# EAGLE schematic BoeBot-Schematic (EAGLE 8.0.2)
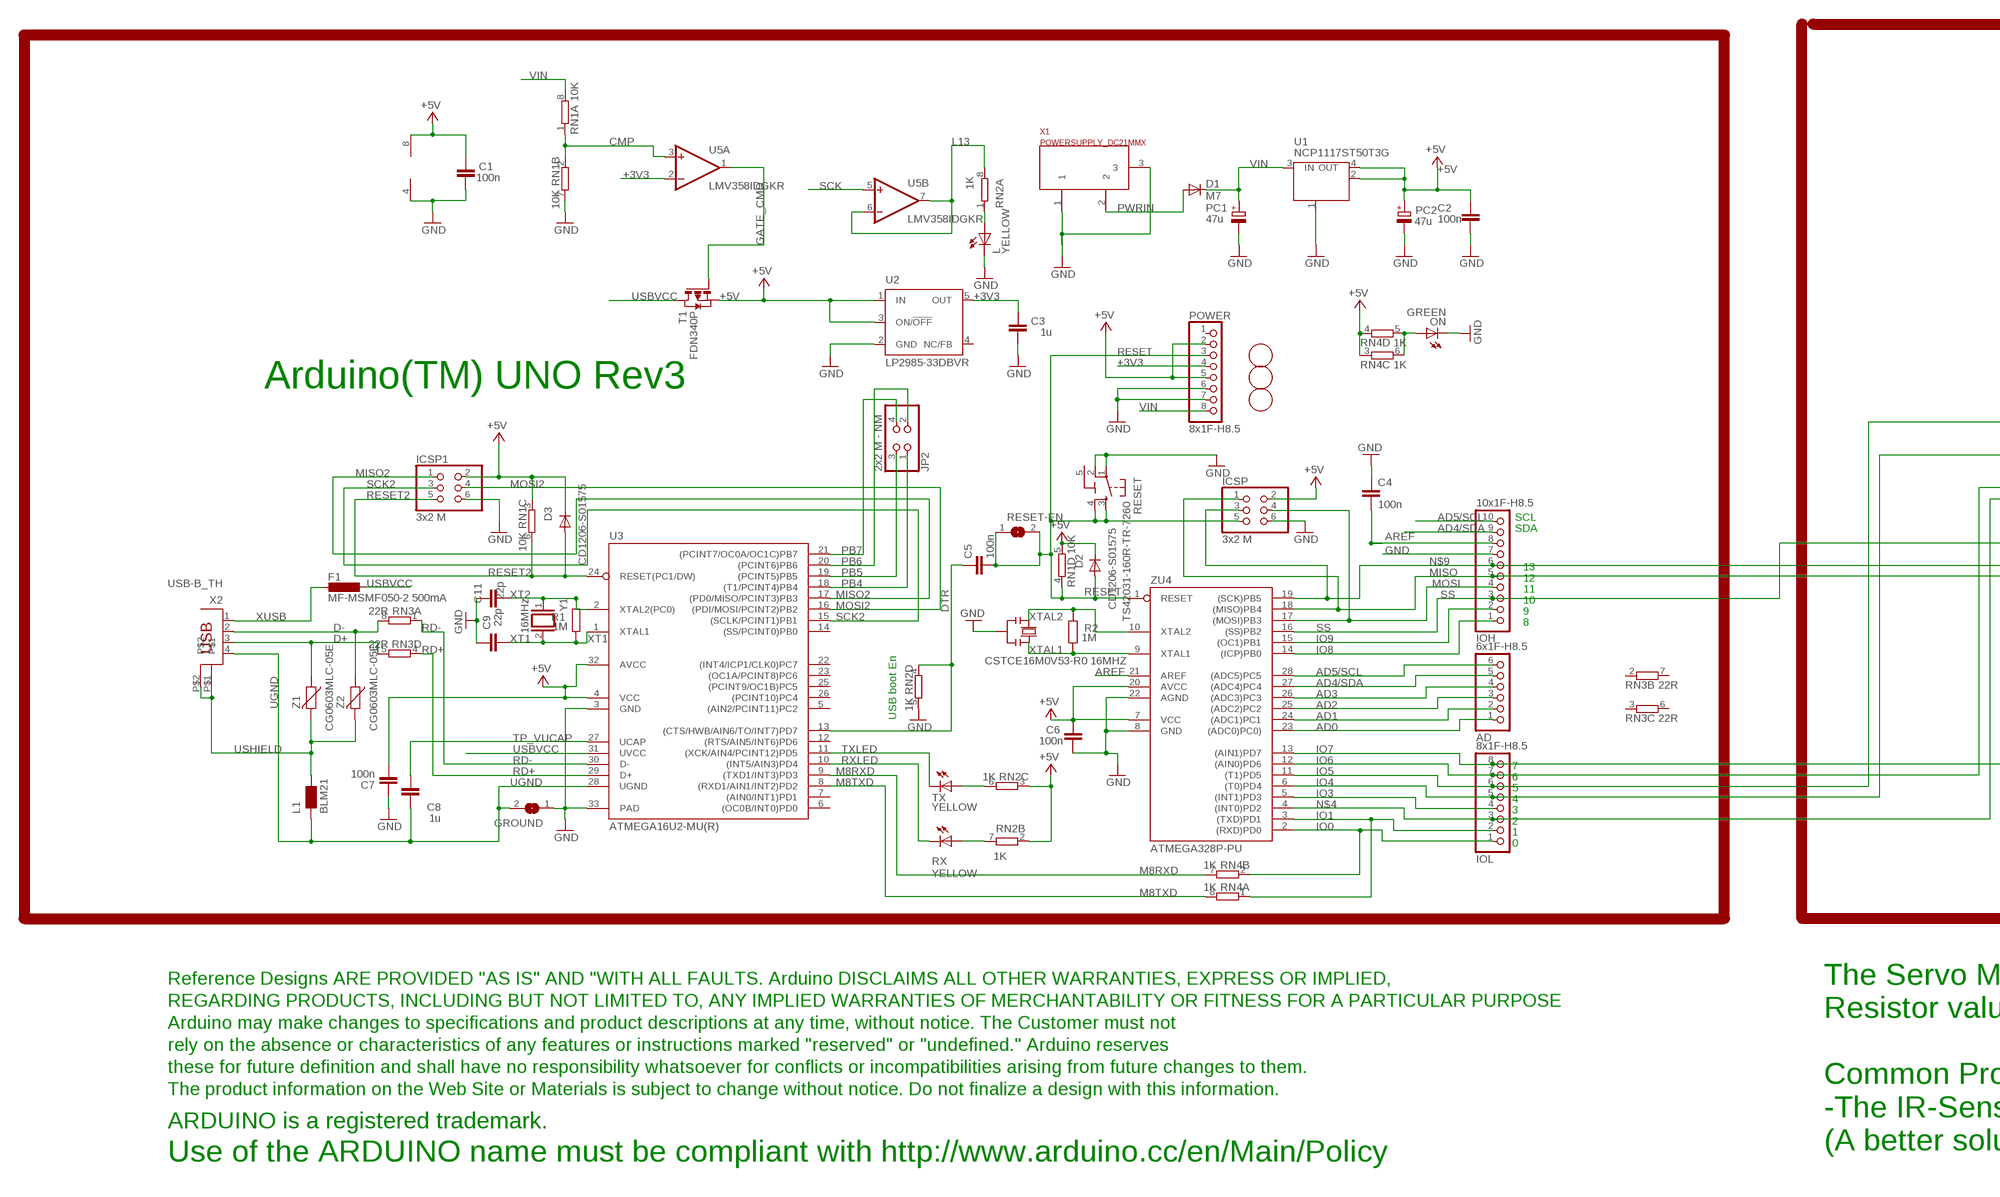
[diagram p0: schematic, sheet 1, part 1 of 2]
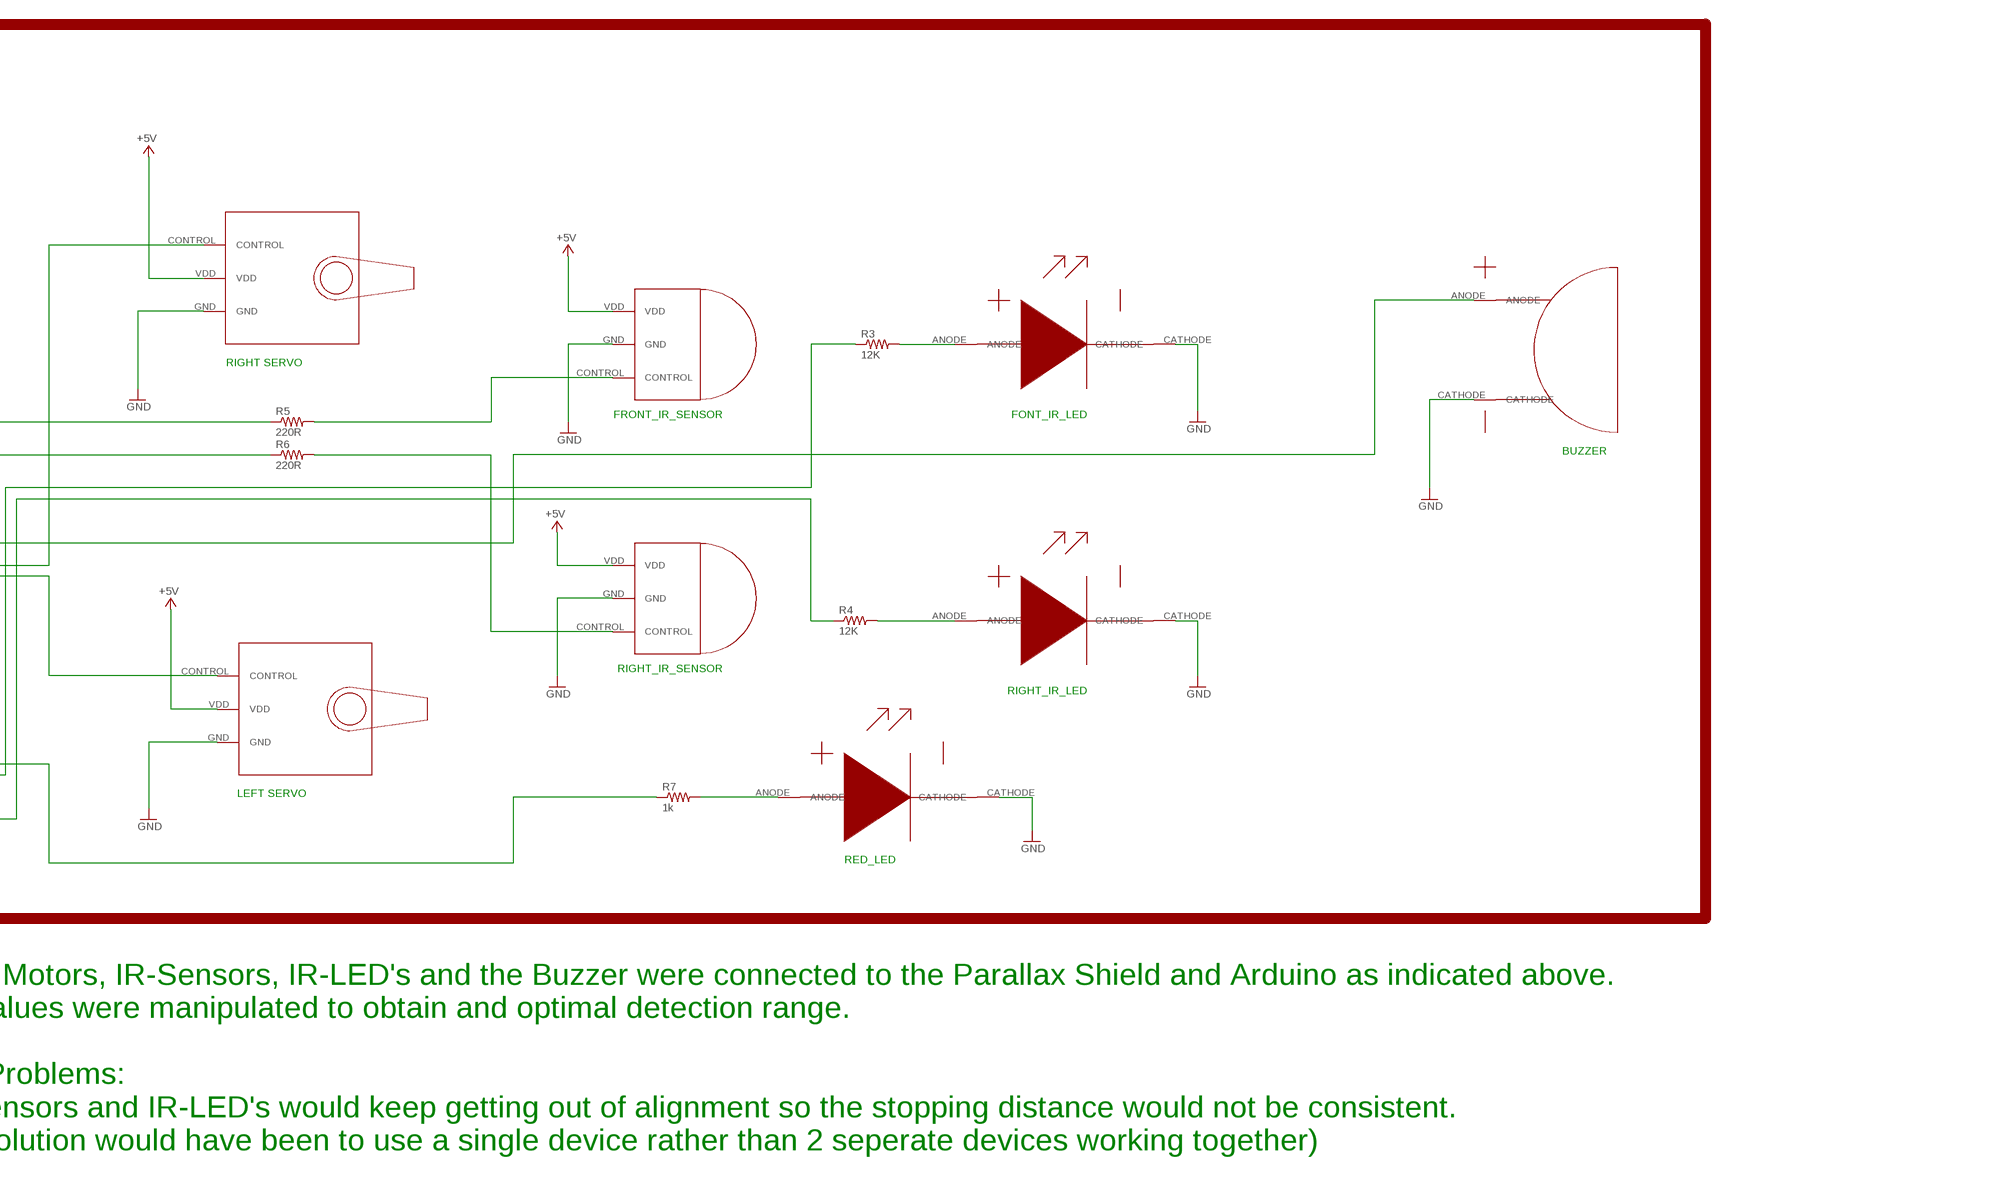
[diagram p1: schematic, sheet 1, part 2 of 2]

## Parts
AD  6x1F-H8.5  PINHD-1X6  [1X06]
C1  100n  C-EU0603-RND  [C0603-ROUND]
C2  100n  C-EU0603-RND  [C0603-ROUND]
C3  1u  C-EU0603-RND  [C0603-ROUND]
C4  100n  C-EU0603-RND  [C0603-ROUND]
C5  100n  C-EU0603-RND  [C0603-ROUND]
C6  100n  C-EU0603-RND  [C0603-ROUND]
C7  100n  C-EU0603-RND  [C0603-ROUND]
C8  1u  C-EU0603-RND  [C0603-ROUND]
C9  22p  C-EU0603-RND  [C0603-ROUND]
C11  22p  C-EU0603-RND  [C0603-ROUND]
D1  M7  DIODE-SMB  [SMB]
D2  CD1206-S01575  DIODE-MINIMELF  [MINIMELF]
D3  CD1206-S01575  DIODE-MINIMELF  [MINIMELF]
F1  MF-MSMF050-2 500mA  L-EUL1812  [L1812]
FD1  FIDUCIALMOUNT  [FIDUCIA-MOUNT]
FD2  FIDUCIALMOUNT  [FIDUCIA-MOUNT]
FD3  FIDUCIALMOUNT  [FIDUCIA-MOUNT]
GROUND  SJ  [SJ]
ICSP  3x2 M  PINHD-2X3  [2X03]
ICSP1  3x2 M  PINHD-2X3  [2X03]
IOH  10x1F-H8.5  PINHD-1X10_ARD  [1X10]
IOL  8x1F-H8.5  PINHD-1X8  [1X08]
JP2  2x2 M - NM  PINHD-2X2  [2X02]
L  YELLOW  LEDCHIP-LED0805  [CHIP-LED0805]
L1  BLM21  WE-CBF_0805  [0805]
ON  GREEN  LEDCHIP-LED0805  [CHIP-LED0805]
PC1  47u  CPOL-EUD  [PANASONIC_D]
PC2  47u  CPOL-EUD  [PANASONIC_D]
POWER  8x1F-H8.5  PINHD-1X8  [1X08]
R1  1M  R-EU_R0603  [R0603-ROUND]
R2  1M  R-EU_R0603  [R0603-ROUND]
R3  12K  R-US_0411/15  [0411/15]
R4  12K  R-US_0411/15  [0411/15]
R5  220R  R-US_0207/2V  [0207/2V]
R6  220R  R-US_0207/2V  [0207/2V]
R7  1k  R-US_0207/2V  [0207/2V]
RESET  TS42031-160R-TR-7260  TS42  [TS42]
RESET-EN  SJ  [SJ]
RIGHT_IR_LED  asdfa  IR_SENSOR  [IR_SENSOR]
RIGHT_SERVO  IR_LED  [IR_LED]
RN1  10K  4R-NCAY16  [CAY16]
RN2  1K  4R-NCAY16  [CAY16]
RN3  22R  4R-NCAY16  [CAY16]
RN4  1K  4R-NCAY16  [CAY16]
RX  YELLOW  LEDCHIP-LED0805  [CHIP-LED0805]
T1  FDN340P  PMOSSOT23  [SOT-23]
TX  YELLOW  LEDCHIP-LED0805  [CHIP-LED0805]
U1  NCP1117ST50T3G  MC33269ST-3.3T3  [SOT223]
U2  LP2985-33DBVR  LP2985-XXDBVR33  [SOT23-DBV]
U3  ATMEGA16U2-MU(R)  ATMEGA16U2-MU  [MLF32]
U5  LMV358IDGKR  LMV358MMX  [MSOP08]
U$1  DISCLAIMER  [DISCLAIMER]
U$2  BUZZER  [BUZZER]
U$3  IR_LED  [IR_LED]
U$4  IR_LED  [IR_LED]
U$5  IR_SENSOR  [IR_SENSOR]
U$6  IR_LED  [IR_LED]
U$7  IR_LED  [IR_LED]
X1  POWERSUPPLY_DC21MMX  [POWERSUPPLY_DC-21MM]
X2  USB-B_TH  PN61729  [PN61729]
Y1  16MHz  XTAL/S  [QS]
Y2  CSTCE16M0V53-R0 16MHZ  RESONATORMU  [RESONATOR]
Z1  CG0603MLC-05E  VARISTORCN0603  [CT/CN0603]
Z2  CG0603MLC-05E  VARISTORCN0603  [CT/CN0603]
ZU4  ATMEGA328P-PU  [DIL28-3]

## Nets
+3V3: C3.2 POWER.4 U2.5(OUT) U5.2(A:-IN)
+5V [usbvcc]: C1.2 C2.2 C6.2 C7.1 D2.C D3.C ICSP1.2 ICSP.2 PC2.+ POWER.2 POWER.5 RIGHT_IR_LED.VDD RIGHT_SERVO.VDD RN1.3 RN1.5 RN2.2 RN2.3 RN4.3 RN4.4 T1.2(S) U1.2(OUT) U1.4(OUT) U2.1(IN) U2.3(ON/!OFF) U3.4(VCC) U3.32(AVCC) U5.8(P:V+) U$3.VDD U$5.VDD ZU4.7(VCC) ZU4.20(AVCC)
AD0: AD.1 ZU4.23((ADC0)PC0))
AD1: AD.2 ZU4.24((ADC1)PC1)
AD2: AD.3 ZU4.25((ADC2)PC2)
AD3: AD.4 ZU4.26((ADC3)PC3)
AD4/SDA: AD.5 IOH.9 ZU4.27((ADC4)PC4)
AD5/SCL: AD.6 IOH.10 ZU4.28((ADC5)PC5)
AREF [aref]: C4.2 IOH.8 ZU4.21(AREF)
CMP: RN1.1 RN1.2 U5.3(A:+IN)
D+: RN3.5 X2.3 Z1.1
D-: RN3.8 X2.2 Z2.1
DTR: C5.1 RN2.4 U3.13((CTS/HWB/AIN6/TO/INT7)PD7)
GATE_CMD: T1.3(G) U5.1(A:OUT)
GND [gnd]: C1.1 C2.1 C3.1 C4.1 C6.1 C7.2 C9.2 C11.2 GROUND.1 ICSP1.6 ICSP.6 IOH.7 L.C ON.C PC1.- PC2.- POWER.6 POWER.7 RESET.1 RESET.2 RIGHT_IR_LED.GND RIGHT_SERVO.GND RN1.7 RN2.5 U1.1(GND/ADJ) U2.2(GND) U3.3(GND) U3.33(PAD) U5.4(P:V-) U$2.CATHODE U$3.GND U$4.CATHODE U$5.GND U$6.CATHODE U$7.CATHODE X1.1 X1.3 Y2.2 ZU4.8(GND) ZU4.22(AGND)
IO0: IOL.1 RN4.2 ZU4.2((RXD)PD0)
IO1: IOL.2 RN4.1 ZU4.3((TXD)PD1)
IO3: IOL.4 ZU4.5((INT1)PD3)
IO4: IOL.5 R6.1 ZU4.6((T0)PD4)
IO5: IOL.6 R5.1 ZU4.11((T1)PD5)
IO6: IOL.7 R3.1 ZU4.12((AIN0)PD6)
IO7: IOL.8 R7.1 ZU4.13((AIN1)PD7)
IO8: IOH.1 ZU4.14((ICP)PB0)
IO9: IOH.2 ZU4.15((OC1)PB1)
L13: RN2.8 U5.6(B:-IN) U5.7(B:OUT)
M8RXD: RN4.7 U3.9((TXD1/INT3)PD3)
M8TXD: RN4.8 U3.8((RXD1/AIN1/INT2)PD2)
MISO: ICSP.1 IOH.5 U$3.CONTROL ZU4.18((MISO)PB4)
MISO2: ICSP1.1 U3.17((PD0/MISO/PCINT3)PB3)
MOSI: ICSP.4 IOH.4 ZU4.17((MOSI)PB3)
MOSI2: ICSP1.4 U3.16((PDI/MOSI/PCINT2)PB2)
N$1: L.A RN2.1
N$2: R4.2 U$7.ANODE
N$3: ON.A RN4.5 RN4.6
N$4: IOL.3 R4.1 ZU4.4((INT0)PD2)
N$5: R3.2 U$6.ANODE
N$6: R5.2 RIGHT_IR_LED.CONTROL
N$7: R6.2 U$5.CONTROL
N$8: R7.2 U$4.ANODE
N$9: ICSP.3 IOH.6 RIGHT_SERVO.CONTROL ZU4.19((SCK)PB5)
N$35: RN2.7 RX.A
N$36: RN2.6 TX.A
PB4: JP2.1 U3.18((T1/PCINT4)PB4)
PB5: JP2.3 U3.19((PCINT5)PB5)
PB6: JP2.2 U3.20((PCINT6)PB6)
PB7: JP2.4 U3.21((PCINT7/OC0A/OC1C)PB7)
PWRIN [power]: D1.A X1.2
RD+: RN3.4 U3.29(D+)
RD-: RN3.1 U3.30(D-)
RESET: C5.2 D2.A ICSP.5 POWER.3 RESET-EN.1 RESET-EN.2 RESET.3 RESET.4 RN1.4 ZU4.1(RESET)
RESET2: D3.A ICSP1.5 RN1.6 U3.24(RESET(PC1/DW))
RXLED: RX.C U3.10((INT5/AIN3)PD4)
SCK: U5.5(B:+IN)
SCK2: ICSP1.3 U3.15((SCLK/PCINT1)PB1)
SS: IOH.3 U$2.ANODE ZU4.16((SS)PB2)
TP_VUCAP: C8.1 U3.27(UCAP)
TXLED: TX.C U3.11((XCK/AIN4/PCINT12)PD5)
UGND [gnd]: C8.2 GROUND.2 L1.1 U3.28(UGND) X2.4
USBVCC [usbvcc]: F1.1 T1.1(D) U3.31(UVCC)
USHIELD [gnd]: L1.2 X2.P$1 X2.P$2 Z1.2 Z2.2
VIN [power]: D1.C PC1.+ POWER.8 RN1.8 U1.3(IN)
XT1: C9.1 R1.1 U3.1(XTAL1) Y1.2
XT2: C11.1 R1.2 U3.2(XTAL2(PC0)) Y1.1
XTAL1: R2.1 Y2.3 ZU4.9(XTAL1)
XTAL2: R2.2 Y2.1 ZU4.10(XTAL2)
XUSB [usbvcc]: F1.2 X2.1
Unconnected: POWER.1 RN3.2 RN3.3 RN3.6 RN3.7 U2.4(NC/FB) U3.5((AIN2/PCINT11)PC2) U3.6((OC0B/INT0)PD0) U3.7((AIN0/INT1)PD1) U3.12((RTS/AIN5/INT6)PD6) U3.14((SS/PCINT0)PB0) U3.22((INT4/ICP1/CLK0)PC7) U3.23((OC1A/PCINT8)PC6) U3.25((PCINT9/OC1B)PC5) U3.26((PCINT10)PC4)

## Notes on the sheet
- RIGHT SERVO
- Arduino(TM) UNO Rev3
- FRONT_IR_SENSOR | FONT_IR_LED
- BUZZER
- SCL
- SDA
- 13
- 12
- 11
- 10
- 9
- 8
- RIGHT_IR_SENSOR
- RIGHT_IR_LED
- USB boot En
- 7
- 6
- 5
- LEFT SERVO
- 4
- 3
- 2
- 1
- 0
- RED_LED
- Use of the ARDUINO name must be compliant with http://www.arduino.cc/en/Main/Policy
- The Servo Motors, IR-Sensors, IR-LED's and the Buzzer were connected to the Parallax Shield and Arduino as indicated above. 
  Resistor values were manipulated to obtain and optimal detection range. 
  
  Common Problems:
  -The IR-Sensors and IR-LED's would keep getting out of alignment so the stopping distance would not be consistent.
  (A better solution would have been to use a single device rather than 2 seperate devices working together)

## Power pins joined to a net without a drawn wire
5-GND: RESET.5(5-GND)

## Library data of the parts
AD = SmartPrj:PINHD-1X6: PIN HEADER
C1-C9 C11 = SmartPrj:C-EU: CAPACITOR, European symbol
D1-D3 = diode:DIODE-: DIODE
F1 = rcl:L-EU: INDUCTOR, European symbol
FD1-FD3 = SmartPrj:FIDUCIALMOUNT
GROUND RESET-EN = jumper:SJ: SMD solder JUMPER
ICSP ICSP1 = SmartPrj:PINHD-2X3: PIN HEADER
IOH = SmartPrj:PINHD-1X10_ARD: PIN HEADER
IOL POWER = SmartPrj:PINHD-1X8: PIN HEADER
JP2 = SmartPrj:PINHD-2X2: PIN HEADER
L ON RX TX = led:LED: LED OSRAM: - CHIPLED LG R971, LG N971, LY N971, LG Q971, LY Q971, LO R971, LY R971 LH N974, LH R974 LS Q976, LO Q976, LY Q976 LO Q996 - Hyper CHIPLED LW Q18S LB Q993, LB Q99A, LB R99A - SideLED LS A670, LO A670, LY A670, LG A670, LP A670 LB A673, LV A673, LT A673, LW A673 LH A674 LY A675 LS A676, LA A676, LO A676, LY A676, LW A676 LS A679, LY A679, LG A679 - Hyper Micro SIDELED® LS Y876, LA Y876, LO Y876, LY Y876 LT Y87S - SmartLED LW L88C, LW L88S LB L89C, LB L89S, LG L890 LS L89K, LO L89K, LY L89K LS L896, LA L896, LO L896, LY L896 - TOPLED LS T670, LO T670, LY T670, LG T670, LP T670 LSG T670, LSP T670, LSY T670, LOP T670, LYG T670 LG T671, LOG T671, LSG T671 LB T673, LV T673, LT T673, LW T673 LH T674 LS T676, LA T676, LO T676, LY T676, LB T676, LH T676, LSB T676, LW T676 LB T67C, LV T67C, LT T67C, LS T67K, LO T67K, LY T67K, LW E67C LS E67B, LA E67B, LO E67B, LY E67B, LB E67C, LV E67C, LT E67C LW T67C LS T679, LY T679, LG T679 LS T770, LO T770, LY T770, LG T770, LP T770 LB T773, LV T773, LT T773, LW T773 LH T774 LS E675, LA E675, LY E675, LS T675 LS T776, LA T776, LO T776, LY T776, LB T776 LHGB T686 LT T68C, LB T68C - Hyper Mini TOPLED® LB M676 - Mini TOPLED Santana® LG M470 LS M47K, LO M47K, LY M47K Source: http://www.osram.convergy.de LUXEON: - LUMILED® LXK2-PW12-R00, LXK2-PW12-S00, LXK2-PW14-U00, LXK2-PW14-V00 LXK2-PM12-R00, LXK2-PM12-S00, LXK2-PM14-U00 LXK2-PE12-Q00, LXK2-PE12-R00, LXK2-PE12-S00, LXK2-PE14-T00, LXK2-PE14-U00 LXK2-PB12-K00, LXK2-PB12-L00, LXK2-PB12-M00, LXK2-PB14-N00, LXK2-PB14-P00, LXK2-PB14-Q00 LXK2-PR12-L00, LXK2-PR12-M00, LXK2-PR14-Q00, LXK2-PR14-R00 LXK2-PD12-Q00, LXK2-PD12-R00, LXK2-PD12-S00 LXK2-PH12-R00, LXK2-PH12-S00 LXK2-PL12-P00, LXK2-PL12-Q00, LXK2-PL12-R00 Source: www.luxeon.com KINGBRIGHT: KA-3528ASYC Source: www.kingbright.com
L1 = wuerth-elektronik:WE-CBF: SMD EMI Suppression Ferrite Beads - excellent anti-EMI properties - low DCR - impedances till 3000 ohms - rated current up to 6 A
PC1 PC2 = rcl:CPOL-EU: POLARIZED CAPACITOR, European symbol
R1 R2 = SmartPrj:R-EU_: RESISTOR, European symbol
R3-R7 = resistor:R-US_: RESISTOR, American symbol
RESET = SmartPrj:TS42: TS42 Dongnan Electronics Tact switch VDC 12V - 50mA
RIGHT_IR_LED U$5 = IR_SENSOR:IR_SENSOR
RIGHT_SERVO U$3 = Servo:IR_LED
RN1-RN4 = resistor-dil:4R-N: Array Chip Resistor Source: RS Component / Phycomp
T1 = zetex:PMOSSOT23: MOS FET
U1 = linear:MC33269ST*: Adjustable Output Low Dropout Voltage Regulator 800 mA Source: http://www.onsemi.com/pub/Collateral/MC33269-D.PDF
U2 = SmartPrj:LP2985-XXDBVR: ULTRALOW-POWER 50-mA LOW-DROPOUT LINEAR REGULATORS 50-mA Low-Dropout Regulator Source: http://focus.ti.com/lit/ds/symlink/tps77001.pdf
U3 = SmartPrj:ATMEGA16U2-
U5 = linear:LMV358?*: Dual General Purpose, Low Voltage, Rail-to-Rail Output Operational Amplifiers Source: http://www.national.com/mpf/LM/LMV321.html http://www.national.com/dt/lmv_qual.pdf
U$1 = SmartPrj:DISCLAIMER
U$2 = BUZZER:BUZZER
U$4 U$6 U$7 = IR_LED:IR_LED
X1 = SmartPrj:POWERSUPPLY_DC21MM
X2 = SmartPrj:PN61729: BERG USB connector
Y1 = SmartPrj:XTAL/S: CRYSTAL
Y2 = SmartPrj:RESONATOR
Z1 Z2 = varistor:VARISTOR: VARISTOR
ZU4 = SmartPrj:ATMEGA328P-: MICROCONTROLLER 4 Kbytes FLASH 128 bytes SRAM 256 bytes EEPROM UART 6-channel 10 bit ADC

## Net classes
0 default: width 0.254 mm, clearance 0.254 mm
1 power: width 0.61 mm, drill 0.61 mm, clearance 0.254 mm
2 gnd: width 0.305 mm, drill 0.559 mm, clearance 0.254 mm
3 usbvcc: width 0.508 mm, drill 0.61 mm, clearance 0.254 mm
4 aref: width 0.406 mm, drill 0.61 mm, clearance 0.254 mm